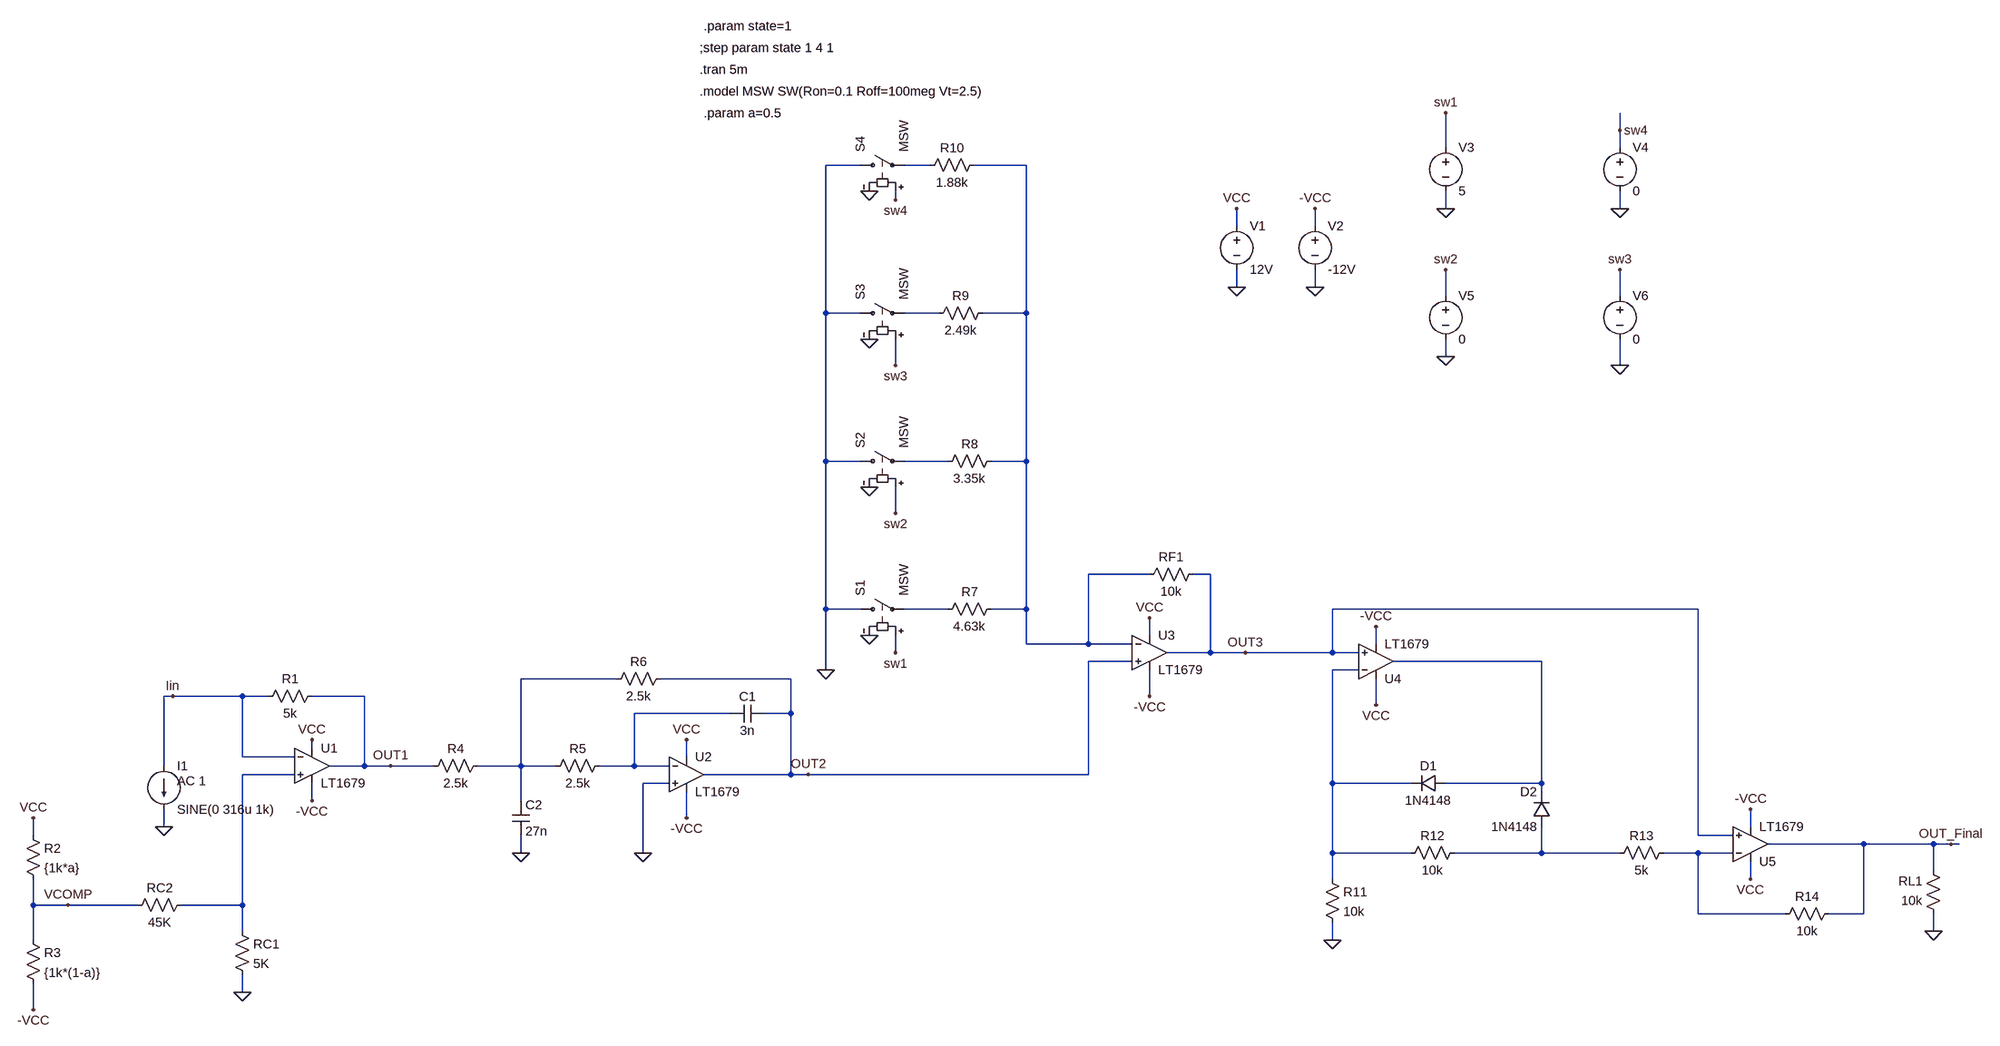
[diagram p0: schematic FullCircuit.asc]
FullCircuit.asc, the LTspice schematic file:
Version 4.1
SHEET 1 6456 1416
WIRE 2496 -400 2496 -432
WIRE 2176 -368 2176 -432
WIRE 2496 -368 2496 -400
WIRE 928 -336 864 -336
WIRE 1056 -336 1008 -336
WIRE 1232 -336 1136 -336
WIRE 992 -272 992 -288
WIRE 2176 -256 2176 -288
WIRE 2496 -256 2496 -288
WIRE 1792 -224 1792 -256
WIRE 1936 -224 1936 -256
WIRE 1792 -112 1792 -144
WIRE 1936 -112 1936 -144
WIRE 2176 -96 2176 -144
WIRE 2496 -96 2496 -144
WIRE 864 -64 864 -336
WIRE 928 -64 864 -64
WIRE 1072 -64 1008 -64
WIRE 1232 -64 1232 -336
WIRE 1232 -64 1152 -64
WIRE 2176 16 2176 -16
WIRE 992 32 992 -16
WIRE 2496 32 2496 -16
WIRE 864 208 864 -64
WIRE 928 208 864 208
WIRE 1088 208 1008 208
WIRE 1232 208 1232 -64
WIRE 1232 208 1168 208
WIRE 992 304 992 256
WIRE 1632 416 1520 416
WIRE 1744 416 1712 416
WIRE 864 480 864 208
WIRE 928 480 864 480
WIRE 1088 480 1008 480
WIRE 1232 480 1232 208
WIRE 1232 480 1168 480
WIRE 2640 480 1968 480
WIRE 1632 528 1632 496
WIRE 1232 544 1232 480
WIRE 1520 544 1520 416
WIRE 1520 544 1232 544
WIRE 1600 544 1520 544
WIRE 2048 544 2048 512
WIRE 992 560 992 528
WIRE 1744 560 1744 416
WIRE 1744 560 1664 560
WIRE 1808 560 1744 560
WIRE 1968 560 1968 480
WIRE 1968 560 1808 560
WIRE 2016 560 1968 560
WIRE 1600 576 1520 576
WIRE 2352 576 2080 576
WIRE 864 592 864 480
WIRE 2016 592 1968 592
WIRE 480 608 304 608
WIRE 800 608 560 608
WIRE -336 640 -352 640
WIRE -208 640 -336 640
WIRE -160 640 -208 640
WIRE 16 640 -80 640
WIRE 1632 640 1632 592
WIRE 2048 656 2048 608
WIRE 688 672 512 672
WIRE 800 672 800 608
WIRE 800 672 752 672
WIRE -80 736 -80 720
WIRE -208 752 -208 640
WIRE -112 752 -208 752
WIRE 608 752 608 720
WIRE -352 768 -352 640
WIRE 16 768 16 640
WIRE 16 768 -48 768
WIRE 64 768 16 768
WIRE 144 768 64 768
WIRE 304 768 304 608
WIRE 304 768 224 768
WIRE 368 768 304 768
WIRE 512 768 512 672
WIRE 512 768 448 768
WIRE 576 768 512 768
WIRE -112 784 -208 784
WIRE 800 784 800 672
WIRE 800 784 640 784
WIRE 832 784 800 784
WIRE 1520 784 1520 576
WIRE 1520 784 832 784
WIRE 576 800 528 800
WIRE 1968 800 1968 592
WIRE 2112 800 1968 800
WIRE 2352 800 2352 576
WIRE 2352 800 2176 800
WIRE 2352 816 2352 800
WIRE -80 832 -80 800
WIRE 304 832 304 768
WIRE 608 864 608 816
WIRE -352 880 -352 848
WIRE 2736 880 2736 848
WIRE -592 896 -592 864
WIRE 2640 896 2640 480
WIRE 2704 896 2640 896
WIRE 2944 912 2768 912
WIRE 3072 912 2944 912
WIRE 3104 912 3072 912
WIRE 3120 912 3104 912
WIRE 304 928 304 896
WIRE 528 928 528 800
WIRE 1968 928 1968 800
WIRE 2112 928 1968 928
WIRE 2352 928 2352 880
WIRE 2352 928 2192 928
WIRE 2496 928 2352 928
WIRE 2640 928 2576 928
WIRE 2704 928 2640 928
WIRE 3072 960 3072 912
WIRE 1968 976 1968 928
WIRE 2736 976 2736 944
WIRE -592 1024 -592 976
WIRE -528 1024 -592 1024
WIRE -400 1024 -528 1024
WIRE -208 1024 -208 784
WIRE -208 1024 -320 1024
WIRE 2640 1040 2640 928
WIRE 2800 1040 2640 1040
WIRE 2944 1040 2944 912
WIRE 2944 1040 2880 1040
WIRE -208 1072 -208 1024
WIRE 3072 1072 3072 1040
WIRE -592 1088 -592 1024
WIRE 1968 1088 1968 1056
WIRE -208 1184 -208 1152
WIRE -592 1216 -592 1168
FLAG -352 880 0
FLAG -208 1184 0
FLAG -336 640 Iin
FLAG -592 864 VCC
FLAG -592 1216 -VCC
FLAG -80 720 VCC
FLAG -80 832 -VCC
FLAG 64 768 OUT1
FLAG -528 1024 VCOMP
FLAG 304 928 0
FLAG 528 928 0
FLAG 608 864 -VCC
FLAG 608 720 VCC
FLAG 832 784 OUT2
FLAG 1632 496 VCC
FLAG 1632 640 -VCC
FLAG 1808 560 OUT3
FLAG 864 592 0
FLAG 944 -288 0
FLAG 944 -16 0
FLAG 944 256 0
FLAG 944 528 0
FLAG 992 -272 sw4
FLAG 992 32 sw3
FLAG 992 304 sw2
FLAG 992 560 sw1
FLAG 2048 656 VCC
FLAG 2048 512 -VCC
FLAG 1968 1088 0
FLAG 3072 1072 0
FLAG 3104 912 OUT_Final
FLAG 2736 976 VCC
FLAG 2736 848 -VCC
FLAG 1792 -256 VCC
FLAG 1936 -256 -VCC
FLAG 1792 -112 0
FLAG 1936 -112 0
FLAG 2176 -256 0
FLAG 2496 -256 0
FLAG 2176 16 0
FLAG 2496 32 0
FLAG 2496 -400 sw4
FLAG 2496 -144 sw3
FLAG 2176 -144 sw2
FLAG 2176 -432 sw1
SYMBOL current -352 768 R0
WINDOW 123 24 28 Left 2
WINDOW 39 0 0 Left 0
SYMATTR Value2 AC 1
SYMATTR InstName I1
SYMATTR Value SINE(0 316u 1k)
SYMBOL res -64 624 R90
WINDOW 0 0 56 VBottom 2
WINDOW 3 32 56 VTop 2
SYMATTR InstName R1
SYMATTR Value 5k
SYMBOL res -224 1056 R0
SYMATTR InstName RC1
SYMATTR Value 5K
SYMBOL res -304 1008 R90
WINDOW 0 0 56 VBottom 2
WINDOW 3 32 56 VTop 2
SYMATTR InstName RC2
SYMATTR Value 45K
SYMBOL res -608 880 R0
SYMATTR InstName R2
SYMATTR Value {1k*a}
SYMBOL res -608 1072 R0
SYMATTR InstName R3
SYMATTR Value {1k*(1-a)}
SYMBOL OpAmps\\LT1679 -80 768 R0
SYMATTR InstName U1
SYMBOL res 240 752 R90
WINDOW 0 0 56 VBottom 2
WINDOW 3 32 56 VTop 2
SYMATTR InstName R4
SYMATTR Value 2.5k
SYMBOL res 464 752 R90
WINDOW 0 0 56 VBottom 2
WINDOW 3 32 56 VTop 2
SYMATTR InstName R5
SYMATTR Value 2.5k
SYMBOL res 576 592 R90
WINDOW 0 0 56 VBottom 2
WINDOW 3 32 56 VTop 2
SYMATTR InstName R6
SYMATTR Value 2.5k
SYMBOL cap 752 656 R90
WINDOW 0 0 32 VBottom 2
WINDOW 3 32 32 VTop 2
SYMATTR InstName C1
SYMATTR Value 3n
SYMBOL cap 288 832 R0
SYMATTR InstName C2
SYMATTR Value 27n
SYMBOL OpAmps\\LT1679 608 784 R0
SYMATTR InstName U2
SYMBOL res 1728 400 R90
WINDOW 0 0 56 VBottom 2
WINDOW 3 32 56 VTop 2
SYMATTR InstName RF1
SYMATTR Value 10k
SYMBOL OpAmps\\LT1679 1632 560 R0
SYMATTR InstName U3
SYMBOL sw 912 480 R270
SYMATTR InstName S1
SYMATTR Value MSW
SYMBOL sw 912 208 R270
SYMATTR InstName S2
SYMATTR Value MSW
SYMBOL sw 912 -64 R270
SYMATTR InstName S3
SYMATTR Value MSW
SYMBOL sw 912 -336 R270
SYMATTR InstName S4
SYMATTR Value MSW
SYMBOL res 1184 464 R90
WINDOW 0 0 56 VBottom 2
WINDOW 3 32 56 VTop 2
SYMATTR InstName R7
SYMATTR Value 4.63k
SYMBOL res 1184 192 R90
WINDOW 0 0 56 VBottom 2
WINDOW 3 32 56 VTop 2
SYMATTR InstName R8
SYMATTR Value 3.35k
SYMBOL res 1168 -80 R90
WINDOW 0 0 56 VBottom 2
WINDOW 3 32 56 VTop 2
SYMATTR InstName R9
SYMATTR Value 2.49k
SYMBOL res 1152 -352 R90
WINDOW 0 0 56 VBottom 2
WINDOW 3 32 56 VTop 2
SYMATTR InstName R10
SYMATTR Value 1.88k
SYMBOL OpAmps\\LT1679 2048 576 M180
SYMATTR InstName U4
SYMBOL diode 2176 784 R90
WINDOW 0 0 32 VBottom 2
WINDOW 3 32 32 VTop 2
SYMATTR InstName D1
SYMATTR Value 1N4148
SYMBOL diode 2368 880 R180
WINDOW 0 24 64 Left 2
WINDOW 3 24 0 Left 2
SYMATTR InstName D2
SYMATTR Value 1N4148
SYMBOL res 1952 960 R0
SYMATTR InstName R11
SYMATTR Value 10k
SYMBOL res 2208 912 R90
WINDOW 0 0 56 VBottom 2
WINDOW 3 32 56 VTop 2
SYMATTR InstName R12
SYMATTR Value 10k
SYMBOL res 2592 912 R90
WINDOW 0 0 56 VBottom 2
WINDOW 3 32 56 VTop 2
SYMATTR InstName R13
SYMATTR Value 5k
SYMBOL res 2896 1024 R90
WINDOW 0 0 56 VBottom 2
WINDOW 3 32 56 VTop 2
SYMATTR InstName R14
SYMATTR Value 10k
SYMBOL res 3088 1056 R180
WINDOW 0 36 76 Left 2
WINDOW 3 36 40 Left 2
SYMATTR InstName RL1
SYMATTR Value 10k
SYMBOL OpAmps\\LT1679 2736 912 M180
SYMATTR InstName U5
SYMBOL voltage 1792 -240 R0
WINDOW 123 0 0 Left 0
WINDOW 39 0 0 Left 0
SYMATTR InstName V1
SYMATTR Value 12V
SYMBOL voltage 1936 -240 R0
WINDOW 123 0 0 Left 0
WINDOW 39 0 0 Left 0
SYMATTR InstName V2
SYMATTR Value -12V
SYMBOL voltage 2176 -384 R0
WINDOW 123 0 0 Left 0
WINDOW 39 0 0 Left 0
SYMATTR InstName V3
SYMATTR Value 5
SYMBOL voltage 2496 -384 R0
WINDOW 123 0 0 Left 0
WINDOW 39 0 0 Left 0
SYMATTR InstName V4
SYMATTR Value 0
SYMBOL voltage 2176 -112 R0
WINDOW 123 0 0 Left 0
WINDOW 39 0 0 Left 0
SYMATTR InstName V5
SYMATTR Value 0
SYMBOL voltage 2496 -112 R0
WINDOW 123 0 0 Left 0
WINDOW 39 0 0 Left 0
SYMATTR InstName V6
SYMATTR Value 0
TEXT 632 -472 Left 2 !.model MSW SW(Ron=0.1 Roff=100meg Vt=2.5)
TEXT 632 -552 Left 2 !;step param state 1 4 1
TEXT 640 -432 Left 2 !.param a=0.5
TEXT 632 -512 Left 2 !.tran 5m
TEXT 640 -592 Left 2 !.param state=1

The netlist it stands for:
* FullCircuit.asc
I1 Iin 0 SINE(0 316u 1k) AC 1
R1 OUT1 Iin 5k
RC1 N010 0 5K
RC2 N010 VCOMP 45K
R2 VCC VCOMP {1k*a}
R3 VCOMP -VCC {1k*(1-a)}
* U1: LT1679 (symbol OpAmps\LT1679 not available, pins judged from their places): In+=N010 In-=Iin V+=VCC V-=-VCC OUT=OUT1
R4 N008 OUT1 2.5k
R5 N009 N008 2.5k
R6 OUT2 N008 2.5k
C1 OUT2 N009 3n
C2 N008 0 27n
* U2: LT1679 (symbol OpAmps\LT1679 not available, pins judged from their places): In+=0 In-=N009 V+=VCC V-=-VCC OUT=OUT2
RF1 OUT3 N002 10k
* U3: LT1679 (symbol OpAmps\LT1679 not available, pins judged from their places): In+=OUT2 In-=N002 V+=VCC V-=-VCC OUT=OUT3
S1 0 N005 sw1 0 MSW
S2 0 N004 sw2 0 MSW
S3 0 N003 sw3 0 MSW
S4 0 N001 sw4 0 MSW
R7 N002 N005 4.63k
R8 N002 N004 3.35k
R9 N002 N003 2.49k
R10 N002 N001 1.88k
* U4: LT1679 (symbol OpAmps\LT1679 not available, pins judged from their places): In+=OUT3 In-=N007 V+=VCC V-=-VCC OUT=N006
D1 N006 N007 1N4148
D2 N011 N006 1N4148
R11 N007 0 10k
R12 N011 N007 10k
R13 N012 N011 5k
R14 OUT_Final N012 10k
RL1 0 OUT_Final 10k
* U5: LT1679 (symbol OpAmps\LT1679 not available, pins judged from their places): In+=OUT3 In-=N012 V+=VCC V-=-VCC OUT=OUT_Final
V1 VCC 0 12V
V2 -VCC 0 -12V
V3 sw1 0 5
V4 sw4 0 0
V5 sw2 0 0
V6 sw3 0 0
.model D D
.lib standard.dio
.model MSW SW(Ron=0.1 Roff=100meg Vt=2.5)
;step param state 1 4 1
.param a=0.5
.tran 5m
.param state=1
.backanno
.end